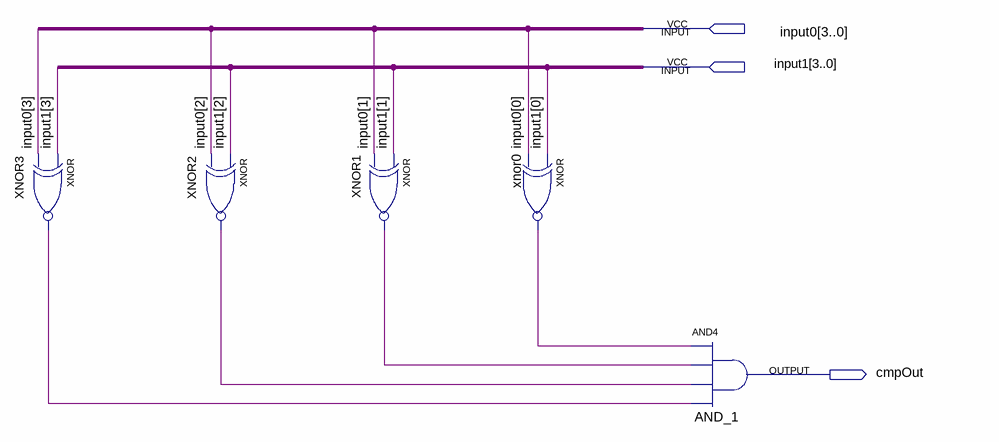
[diagram p0: schematic sheet]
// Quartus schematic EqCmp4.bdf as structural Verilog: 5 symbols, 3 pins
module EqCmp4 (
  input  [3:0] input0,
  input  [3:0] input1,
  output cmpOut
);

  wire xnor0_out, XNOR1_out, XNOR2_out, XNOR3_out;

  xnor XNOR3 (XNOR3_out, input1[3], input0[3]);
  xnor XNOR2 (XNOR2_out, input1[2], input0[2]);
  xnor XNOR1 (XNOR1_out, input1[1], input0[1]);
  xnor xnor0 (xnor0_out, input1[0], input0[0]);
  and AND_1 (cmpOut, xnor0_out, XNOR1_out, XNOR2_out, XNOR3_out);
endmodule
